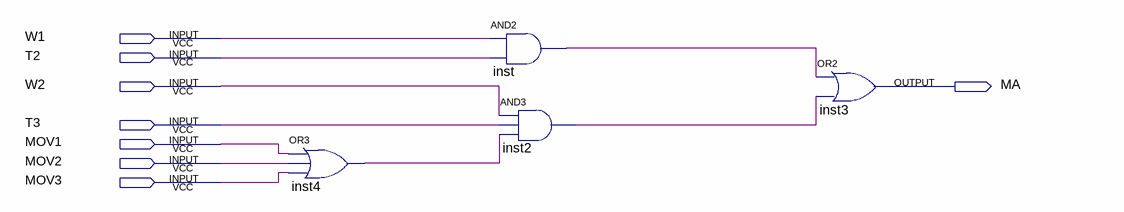
[diagram p0: schematic sheet]
// Quartus schematic MA.bdf as structural Verilog: 4 symbols, 8 pins
module MA (
  input  W1,
  input  T2,
  input  W2,
  input  T3,
  input  MOV1,
  input  MOV2,
  input  MOV3,
  output MA
);

  wire inst2_out, inst4_out, inst_out;

  or inst4 (inst4_out, MOV1, MOV2, MOV3);
  and inst (inst_out, W1, T2);
  and inst2 (inst2_out, W2, T3, inst4_out);
  or inst3 (MA, inst_out, inst2_out);
endmodule
